# EAGLE schematic TinyCube11b_Lib (EAGLE 7.5.0)
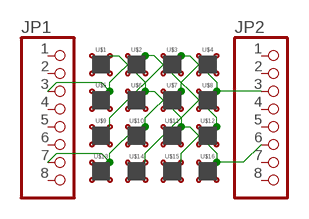
[diagram p0: schematic, sheet 1]

## Parts
JP1  PINHD-1X8BIG  [1X08-BIG]
JP2  PINHD-1X8BIG  [1X08-BIG]
U$1  PILLAR  [10MIL]
U$2  PILLAR  [10MIL]
U$3  PILLAR  [10MIL]
U$4  PILLAR  [10MIL]
U$5  PILLAR  [10MIL]
U$6  PILLAR  [10MIL]
U$7  PILLAR  [10MIL]
U$8  PILLAR  [10MIL]
U$9  PILLAR  [10MIL]
U$10  PILLAR  [10MIL]
U$11  PILLAR  [10MIL]
U$12  PILLAR  [10MIL]
U$13  PILLAR  [10MIL]
U$14  PILLAR  [10MIL]
U$15  PILLAR  [10MIL]
U$16  PILLAR  [10MIL]

## Nets
N$1: JP1.3 U$2.+(G) U$5.+(G) U$12.+(G) U$15.+(G)
N$2: JP1.7 U$4.+(G) U$7.+(G) U$10.+(G) U$13.+(G)
N$3: JP2.6 U$1.+(G) U$6.+(G) U$11.+(G) U$16.+(G)
N$4: JP2.3 U$3.+(G) U$8.+(G) U$9.+(G) U$14.+(G)
Unconnected: JP1.1 JP1.2 JP1.4 JP1.5 JP1.6 JP1.8 JP2.1 JP2.2 JP2.4 JP2.5 JP2.7 JP2.8 U$1.B(R) U$1.G(A) U$1.R(B) U$2.B(R) U$2.G(A) U$2.R(B) U$3.B(R) U$3.G(A) U$3.R(B) U$4.B(R) U$4.G(A) U$4.R(B) U$5.B(R) U$5.G(A) U$5.R(B) U$6.B(R) U$6.G(A) U$6.R(B) U$7.B(R) U$7.G(A) U$7.R(B) U$8.B(R) U$8.G(A) U$8.R(B) U$9.B(R) U$9.G(A) U$9.R(B) U$10.B(R) U$10.G(A) U$10.R(B) U$11.B(R) U$11.G(A) U$11.R(B) U$12.B(R) U$12.G(A) U$12.R(B) U$13.B(R) U$13.G(A) U$13.R(B) U$14.B(R) U$14.G(A) U$14.R(B) U$15.B(R) U$15.G(A) U$15.R(B) U$16.B(R) U$16.G(A) U$16.R(B)

## Library data of the parts
JP1 JP2 = adafruit:PINHD-1X8: PIN HEADER
U$1-U$16 = PILLAR:PILLAR